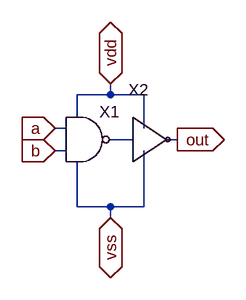
[diagram p0: schematic and.asc]
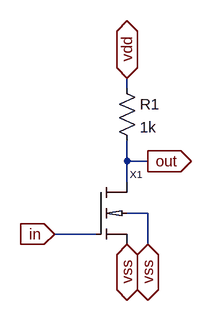
[diagram p1: sub-circuit not.asc]
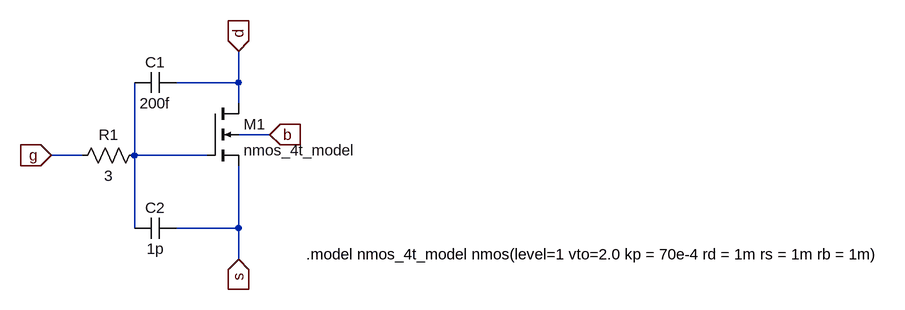
[diagram p2: sub-circuit nmos_4t.asc]
and.asc, the LTspice schematic file:
Version 4
SHEET 1 880 680
WIRE 64 16 64 0
WIRE 64 16 16 16
WIRE 112 16 64 16
WIRE 16 48 16 16
WIRE 0 64 -16 64
WIRE 112 64 112 16
WIRE 96 80 64 80
WIRE 160 80 144 80
WIRE 0 96 -16 96
WIRE 16 176 16 112
WIRE 64 176 16 176
WIRE 112 176 112 96
WIRE 112 176 64 176
WIRE 64 192 64 176
FLAG -16 64 a
IOPIN -16 64 In
FLAG -16 96 b
IOPIN -16 96 In
FLAG 64 0 vdd
IOPIN 64 0 BiDir
FLAG 64 192 vss
IOPIN 64 192 BiDir
FLAG 160 80 out
IOPIN 160 80 Out
SYMBOL nand 32 16 R0
SYMATTR InstName X1
SYMBOL not 96 80 R0
SYMATTR InstName X2
SYMATTR Value ""

not.asc, the sub-circuit schematic file:
Version 4
SHEET 1 880 680
WIRE 176 -96 176 -112
WIRE 176 16 176 -16
WIRE 208 16 176 16
WIRE 176 48 176 16
WIRE 208 96 176 96
WIRE 128 128 64 128
WIRE 208 144 208 96
FLAG 64 128 in
IOPIN 64 128 In
FLAG 176 144 vss
IOPIN 176 144 BiDir
FLAG 176 -112 vdd
IOPIN 176 -112 BiDir
FLAG 208 16 out
IOPIN 208 16 Out
FLAG 208 144 vss
IOPIN 208 144 BiDir
SYMBOL res 160 -112 R0
SYMATTR InstName R1
SYMATTR Value 1k
SYMBOL nmos_4t 128 48 R0
SYMATTR InstName X1

nmos_4t.asc, the sub-circuit schematic file:
Version 4
SHEET 1 880 680
WIRE -288 -224 -288 -272
WIRE -288 -224 -384 -224
WIRE -288 -192 -288 -224
WIRE -240 -144 -288 -144
WIRE -528 -112 -576 -112
WIRE -448 -112 -448 -224
WIRE -336 -112 -448 -112
WIRE -448 0 -448 -112
WIRE -288 0 -288 -96
WIRE -288 0 -384 0
WIRE -288 48 -288 0
FLAG -576 -112 g
IOPIN -576 -112 In
FLAG -288 -272 d
IOPIN -288 -272 In
FLAG -288 48 s
IOPIN -288 48 In
FLAG -240 -144 b
IOPIN -240 -144 In
SYMBOL nmos4 -336 -192 R0
SYMATTR InstName M1
SYMATTR Value nmos_4t_model
SYMBOL cap -384 -240 R90
WINDOW 0 0 32 VBottom 2
WINDOW 3 32 32 VTop 2
SYMATTR InstName C1
SYMATTR Value 200f
SYMBOL cap -384 -16 R90
WINDOW 0 0 32 VBottom 2
WINDOW 3 32 32 VTop 2
SYMATTR InstName C2
SYMATTR Value 1p
SYMBOL res -432 -128 R90
WINDOW 0 0 56 VBottom 2
WINDOW 3 32 56 VTop 2
SYMATTR InstName R1
SYMATTR Value 3
TEXT -184 40 Left 2 !.model nmos_4t_model nmos(level=1 vto=2.0 kp = 70e-4 rd = 1m rs = 1m rb = 1m)

The netlist it stands for:
* and.asc
XX1 a b vdd vss N001 nand  ; pins a b vdd vss out
XX2 N001 out vss vdd not

* block symbol definitions
.subckt not in out vss vdd
R1 vdd out 1k
XX1 out in vss vss nmos_4t
.ends not

.subckt nmos_4t D G S B
M1 d N001 s b nmos_4t_model
C1 d N001 200f
C2 s N001 1p
R1 N001 g 3
.model nmos_4t_model nmos(level=1 vto=2.0 kp = 70e-4 rd = 1m rs = 1m rb = 1m)
.ends nmos_4t

.model NMOS NMOS
.model PMOS PMOS
.lib standard.mos
.backanno
.end